# EAGLE design Clock Schematic v.8_no_jumpers (EAGLE 9.3.0)
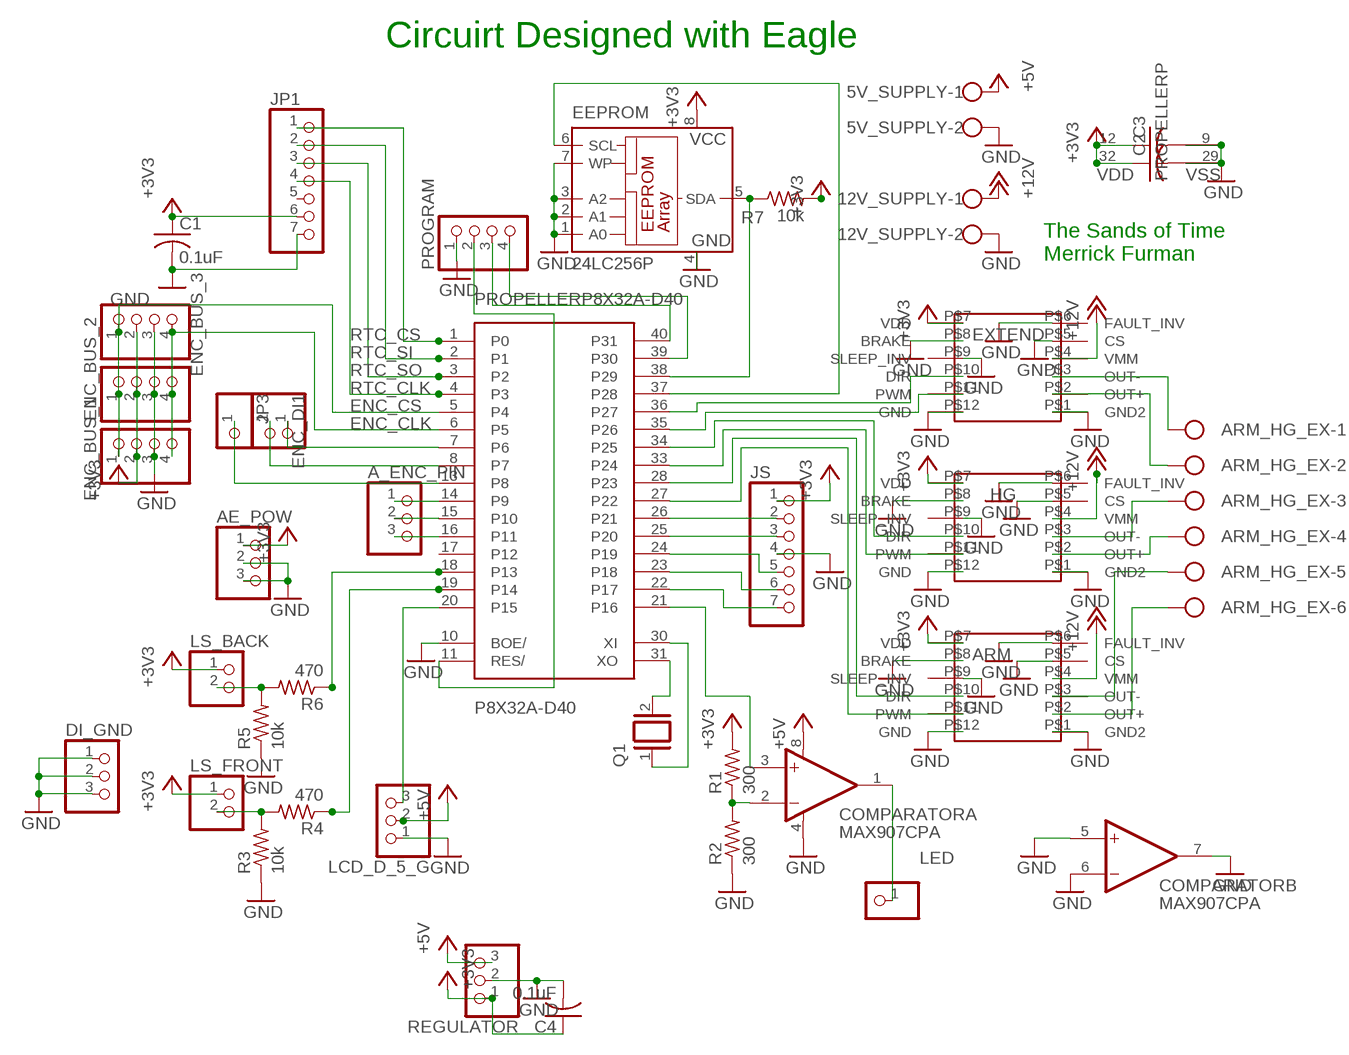
[diagram p0: schematic, sheet 1]

## Parts
5V_SUPPLY  W237-102  [W237-102]
12V_SUPPLY  W237-102  [W237-102]
A_ENC_PIN  PINHD-1X3  [1X03]
AE_POW  PINHD-1X3  [1X03]
ARM  DRV  [DRV]
ARM_HG_EX  W237-6  [W237-6]
C1  0.1uF  C-US050-025X075  [C050-025X075]
C2  C-US050-025X075  [C050-025X075]
C3  C-US050-025X075  [C050-025X075]
C4  0.1uF  C-US025-030X050  [C025-030X050]
COMPARATOR  MAX907CPA  [DIL08]
DI_GND  PINHD-1X3  [1X03]
EEPROM  24LC256P  [DIL8]
ENC_BUS_1  PINHD-1X4  [1X04]
ENC_BUS_2  PINHD-1X4  [1X04]
ENC_BUS_3  PINHD-1X4  [1X04]
ENC_DI1  PINHD-1X2  [1X02]
EXTEND  DRV  [DRV]
HG  DRV  [DRV]
JP1  PINHD-1X7  [1X07]
JP3  PINHD-1X1  [1X01]
JS  PINHD-1X7  [1X07]
LCD_D_5_G  PINHD-1X3  [1X03]
LED  PINHD-1X1  [1X01]
LS_BACK  PINHD-1X2  [1X02]
LS_FRONT  PINHD-1X2  [1X02]
PROGRAM  PINHD-1X4  [1X04]
PROPELLER  P8X32A-D40  [P8X32A-D40]
Q1  XTAL/S  [QS]
R1  300  R-US_0207/10  [0207/10]
R2  300  R-US_0207/10  [0207/10]
R3  10k  R-US_0207/10  [0207/10]
R4  470  R-US_0207/10  [0207/10]
R5  10k  R-US_0207/10  [0207/10]
R6  470  R-US_0207/10  [0207/10]
R7  10k  R-US_0207/10  [0207/10]
REGULATOR  PINHD-1X3  [1X03]

## Nets
+3V3: AE_POW.1 ARM.P$7(VDD) C1.1 C2.1 C3.1 C4.1 EEPROM.8(VCC) ENC_BUS_1.2 ENC_BUS_2.2 ENC_BUS_3.2 EXTEND.P$7(VDD) HG.P$7(VDD) JP1.6 JS.1 LS_BACK.1 LS_FRONT.1 PROPELLER.12(P:VDD) PROPELLER.32(P:VDD) R1.2 R7.2 REGULATOR.1
+5V: 5V_SUPPLY.1 COMPARATOR.8(A:V+) LCD_D_5_G.2 REGULATOR.3
+12V: 12V_SUPPLY.1 ARM.P$4(VMM) EXTEND.P$4(VMM) HG.P$4(VMM)
ENC_CLK: ENC_BUS_1.4 ENC_BUS_2.4 ENC_BUS_3.4 PROPELLER.6(P8X32A-D40:P5)
ENC_CS: ENC_BUS_1.1 ENC_BUS_2.1 ENC_BUS_3.1 PROPELLER.5(P8X32A-D40:P4)
GND: 5V_SUPPLY.2 12V_SUPPLY.2 AE_POW.2 AE_POW.3 ARM.P$1(GND2) ARM.P$5(CS) ARM.P$6(FAULT_INV) ARM.P$8(BRAKE) ARM.P$9(SLEEP_INV) ARM.P$12(GND) C1.2 C2.2 C3.2 C4.2 COMPARATOR.4(A:V-) COMPARATOR.5(B:+IN) COMPARATOR.6(B:-IN) COMPARATOR.7(B:OUT) DI_GND.1 DI_GND.2 DI_GND.3 EEPROM.1(A0) EEPROM.2(A1) EEPROM.3(A2) EEPROM.4(GND) EEPROM.7(WP) ENC_BUS_1.3 ENC_BUS_2.3 ENC_BUS_3.3 EXTEND.P$1(GND2) EXTEND.P$5(CS) EXTEND.P$6(FAULT_INV) EXTEND.P$8(BRAKE) EXTEND.P$9(SLEEP_INV) EXTEND.P$12(GND) HG.P$1(GND2) HG.P$5(CS) HG.P$6(FAULT_INV) HG.P$8(BRAKE) HG.P$9(SLEEP_INV) HG.P$12(GND) JP1.7 JS.4 LCD_D_5_G.1 PROGRAM.1 PROPELLER.9(P:VSS) PROPELLER.10(P8X32A-D40:BOE/) PROPELLER.29(P:VSS) R2.1 R3.1 R5.1 REGULATOR.2
N$1: ENC_DI1.1 PROPELLER.7(P8X32A-D40:P6)
N$2: JS.5 PROPELLER.24(P8X32A-D40:P19)
N$3: JS.6 PROPELLER.23(P8X32A-D40:P18)
N$4: JS.7 PROPELLER.22(P8X32A-D40:P17)
N$5: JS.3 PROPELLER.25(P8X32A-D40:P20)
N$6: JS.2 PROPELLER.26(P8X32A-D40:P21)
N$7: LCD_D_5_G.3 PROPELLER.20(P8X32A-D40:P15)
N$8: ENC_DI1.2 PROPELLER.8(P8X32A-D40:P7)
N$9: COMPARATOR.1(A:OUT) LED.1
N$10: PROPELLER.31(P8X32A-D40:XO) Q1.2
N$11: COMPARATOR.2(A:-IN) R1.1 R2.2
N$12: PROPELLER.30(P8X32A-D40:XI) Q1.1
N$13: PROPELLER.19(P8X32A-D40:P14) R4.1
N$14: LS_BACK.2 R5.2 R6.2
N$15: PROPELLER.18(P8X32A-D40:P13) R6.1
N$16: EEPROM.6(SCL) PROPELLER.37(P8X32A-D40:P28)
N$17: ARM.P$11(PWM) PROPELLER.27(P8X32A-D40:P22)
N$18: PROGRAM.4 PROPELLER.39(P8X32A-D40:P30)
N$19: PROGRAM.3 PROPELLER.40(P8X32A-D40:P31)
N$20: EEPROM.5(SDA) PROPELLER.38(P8X32A-D40:P29) R7.1
N$21: COMPARATOR.3(A:+IN) PROPELLER.21(P8X32A-D40:P16)
N$22: ARM.P$10(DIR) PROPELLER.28(P8X32A-D40:P23)
N$23: HG.P$11(PWM) PROPELLER.33(P8X32A-D40:P24)
N$24: HG.P$10(DIR) PROPELLER.34(P8X32A-D40:P25)
N$25: EXTEND.P$11(PWM) PROPELLER.35(P8X32A-D40:P26)
N$26: PROGRAM.2 PROPELLER.11(P8X32A-D40:RES/)
N$27: LS_FRONT.2 R3.2 R4.2
N$28: EXTEND.P$10(DIR) PROPELLER.36(P8X32A-D40:P27)
N$29: ARM_HG_EX.1 EXTEND.P$3(OUT-)
N$30: ARM_HG_EX.2 EXTEND.P$2(OUT+)
N$31: ARM_HG_EX.3 HG.P$3(OUT-)
N$32: ARM_HG_EX.4 HG.P$2(OUT+)
N$33: ARM.P$3(OUT-) ARM_HG_EX.5
N$34: ARM.P$2(OUT+) ARM_HG_EX.6
N$35: JP3.1 PROPELLER.13(P8X32A-D40:P8)
N$36: A_ENC_PIN.1 PROPELLER.14(P8X32A-D40:P9)
N$37: A_ENC_PIN.2 PROPELLER.15(P8X32A-D40:P10)
N$38: A_ENC_PIN.3 PROPELLER.16(P8X32A-D40:P11)
RTC_CLK: JP1.4 PROPELLER.4(P8X32A-D40:P3)
RTC_CS: JP1.1 PROPELLER.1(P8X32A-D40:P0)
RTC_SI: JP1.2 PROPELLER.2(P8X32A-D40:P1)
RTC_SO: JP1.3 PROPELLER.3(P8X32A-D40:P2)
Unconnected: JP1.5 PROPELLER.17(P8X32A-D40:P12)

## Notes on the sheet
- Circuirt Designed with Eagle
- The Sands of Time
  Merrick Furman

## Library data of the parts
5V_SUPPLY 12V_SUPPLY = con-wago-500:W237-102: WAGO SCREW CLAMP; MPN: 237-102; OC_FARNELL: unknown; OC_NEWARK: 70K9898
A_ENC_PIN AE_POW DI_GND LCD_D_5_G REGULATOR = pinhead:PINHD-1X3: PIN HEADER
ARM EXTEND HG = Pololu_DRV8801_Breakout:DRV
ARM_HG_EX = con-wago-500:W237-6: WAGO SCREW CLAMP; OC_FARNELL: unknown; OC_NEWARK: unknown
C1-C4 = rcl:C-US: CAPACITOR, American symbol; SPICEPREFIX: C
COMPARATOR = maxim:MAX907CPA: COMPARATOR; MF: MAXIM; MPN: MAX907CPA; OC_FARNELL: unknown; OC_NEWARK: 79C3004; SPICEPREFIX: X
EEPROM = microchip:24*: Serial EEPROM I2C; MF: MICROCHIP; MPN: 24LC256-E/P; OC_FARNELL: 9757970; OC_NEWARK: 92C7169
ENC_BUS_1-ENC_BUS_3 PROGRAM = pinhead:PINHD-1X4: PIN HEADER
ENC_DI1 LS_BACK LS_FRONT = pinhead:PINHD-1X2: PIN HEADER
JP1 JS = pinhead:PINHD-1X7: PIN HEADER
JP3 LED = pinhead:PINHD-1X1: PIN HEADER
PROPELLER = parallax_propeller:P8X32A-D40
Q1 = special:XTAL/S: CRYSTAL
R1-R7 = rcl:R-US_: RESISTOR, American symbol; SPICEPREFIX: R

## Board
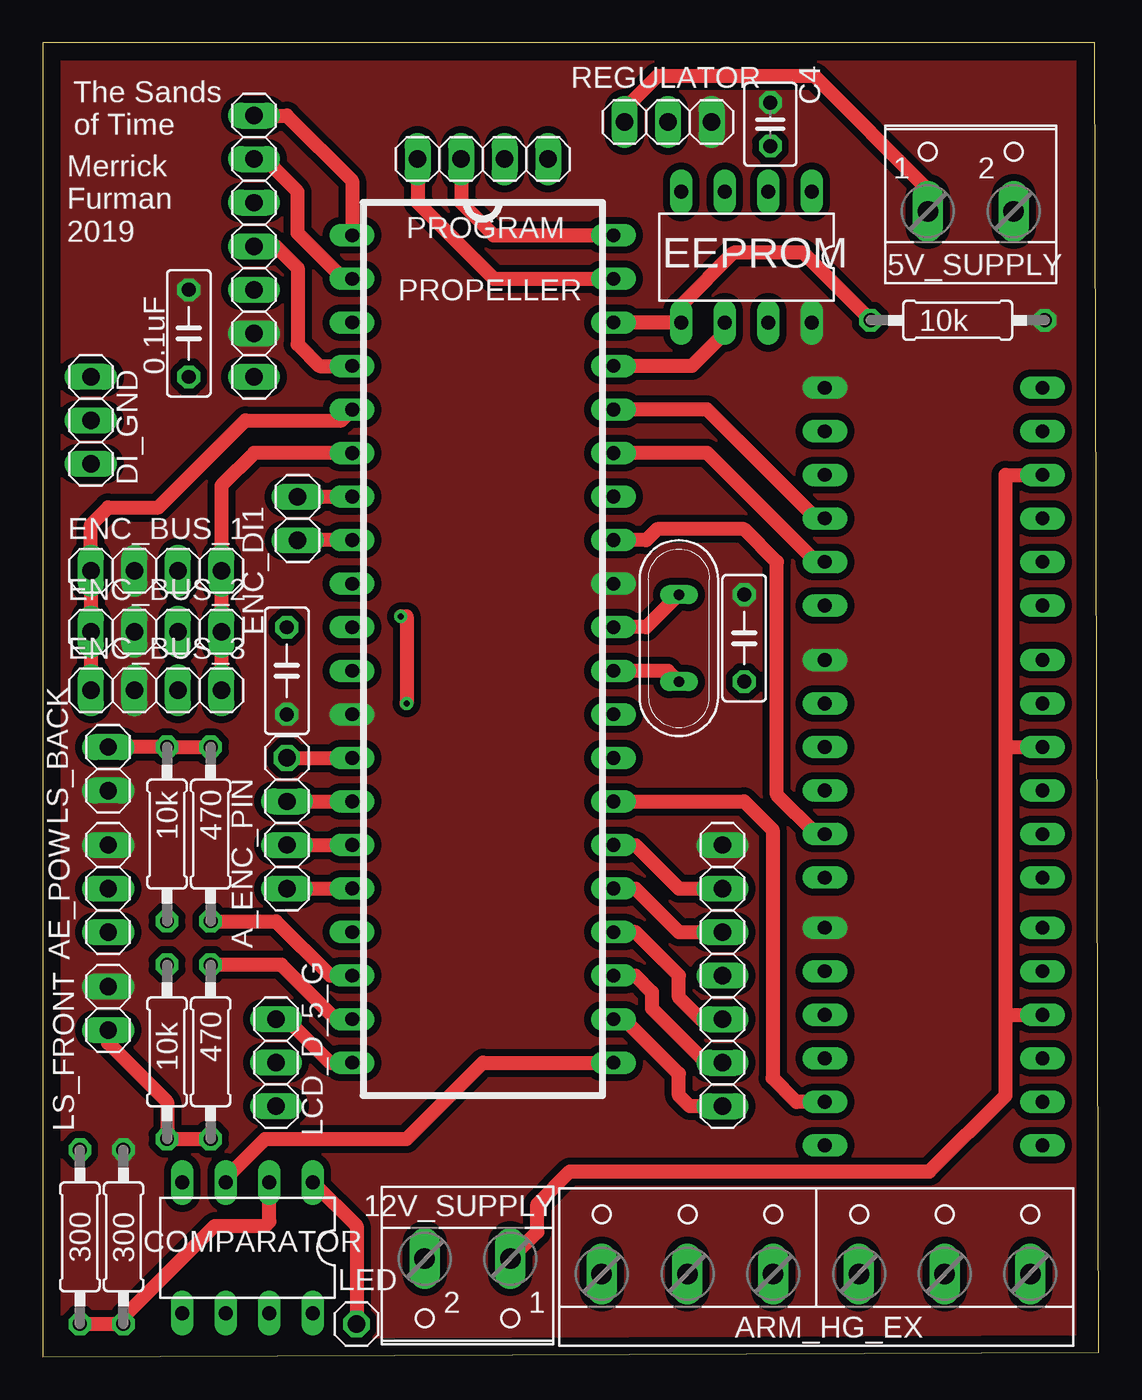
[diagram p1: board, top side]
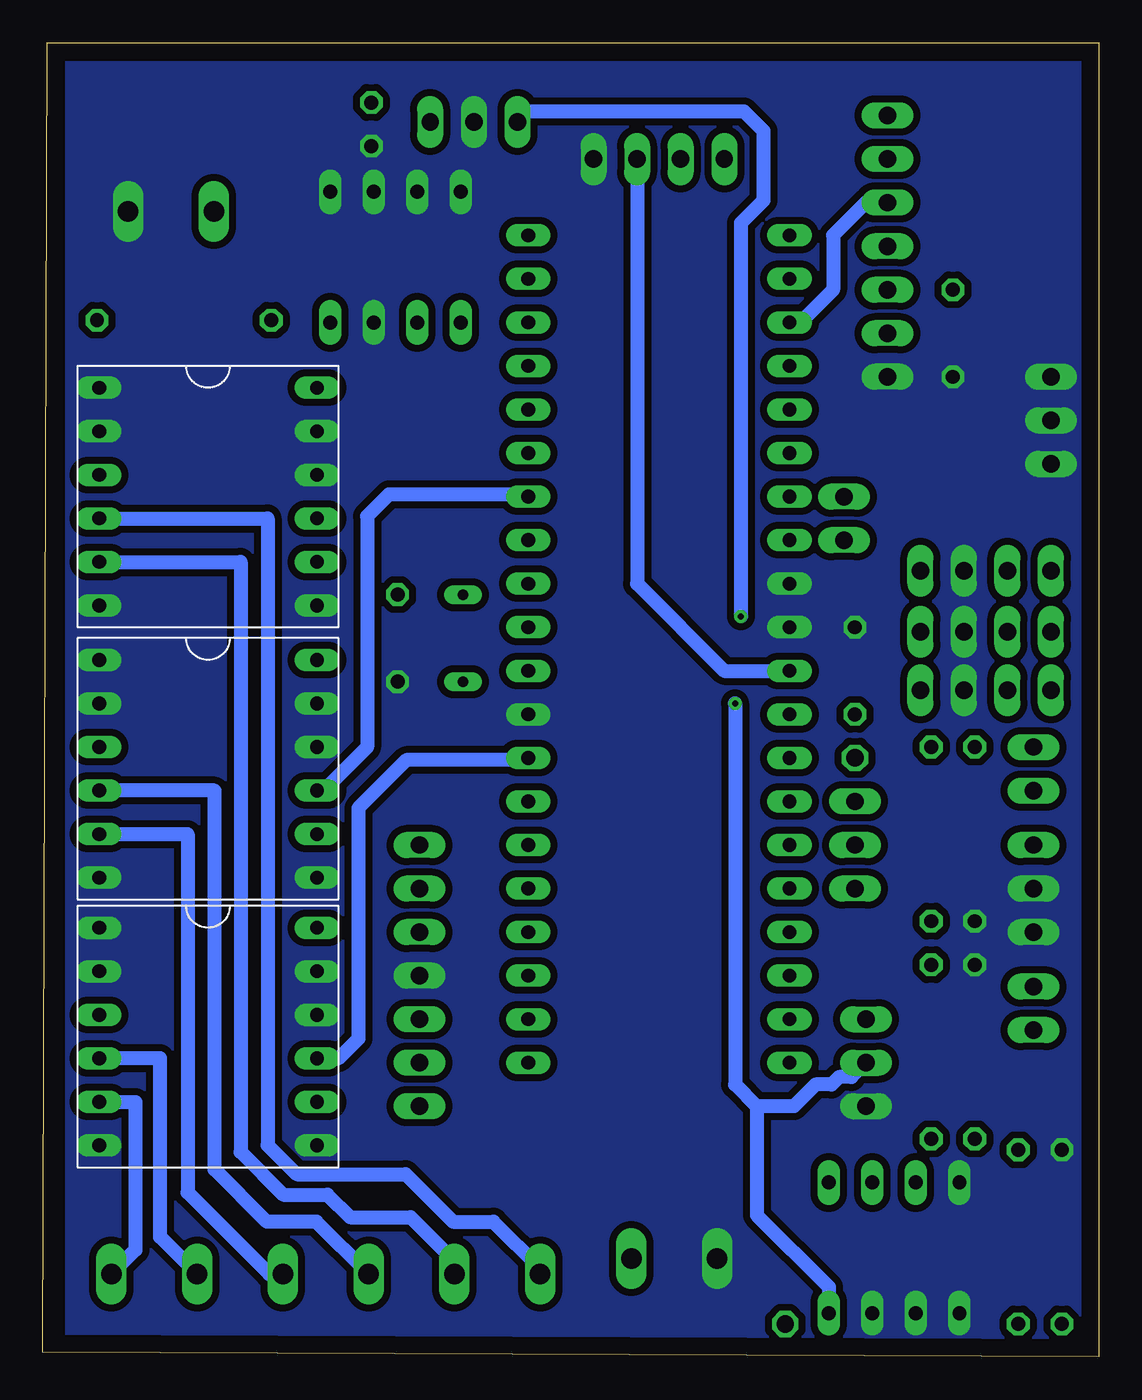
[diagram p2: board, bottom side, seen from below]

Size 61.58 x 76.63 mm. Coordinates in mm from the lower left corner, seen from the top.
Outline: 0,0 61.58,0.25 61.32,76.63 0,76.63 0,0
Copper layers (1*16): Top 0.035mm / dielectric 1.5mm / Bottom 0.035mm
Design rules "default *": minimum track width 6mil, minimum drill 0.35mm, track to track 15mil, track to pad 15mil, pad to pad 15mil, via to via 15mil, smd to smd 15mil, copper to edge 40mil, drill to drill 6mil, minimum pad ring 10mil, minimum via ring 8mil, stop-mask expansion 4mil, vias tented up to drill 0mil, thermal gap 10mil

### Footprints (pad centres in the part's own frame; a part is rotated, then mirrored left to right if it is on the bottom)
W237-102 = drill 1.194 long: 1 -2.5,-1.27; 2 2.5,-1.27
1X03 = drill 1.016 long: 1 -2.54,0; 2 0,0; 3 2.54,0
DRV = drill 0.8 long: P$1 1.27,1.27; P$2 1.27,3.81; P$3 1.27,6.35; P$4 1.27,8.89; P$5 1.27,11.43; P$6 1.27,13.97; P$7 13.97,13.97; P$8 13.97,11.43; P$9 13.97,8.89; P$10 13.97,6.35; P$11 13.97,3.81; P$12 13.97,1.27
W237-6 = drill 1.194 long: 1 -12.5,-1.27; 2 -7.5,-1.27; 3 -2.5,-1.27; 4 2.5,-1.27; 5 7.5,-1.27; 6 12.5,-1.27
C050-025X075 = drill 0.813 octagon: 1 -2.54,0; 2 2.54,0
C025-030X050 = drill 0.813 octagon: 1 -1.27,0; 2 1.27,0
DIL08 = drill 0.813 long: 1 -3.81,-3.81; 2 -1.27,-3.81; 3 1.27,-3.81; 4 3.81,-3.81; 5 3.81,3.81; 6 1.27,3.81; 7 -1.27,3.81; 8 -3.81,3.81
DIL8 = drill 0.813 long: 1 -3.81,-3.81; 2 -1.27,-3.81; 3 1.27,-3.81; 4 3.81,-3.81; 5 3.81,3.81; 6 1.27,3.81; 7 -1.27,3.81; 8 -3.81,3.81
1X04 = drill 1.016 long: 1 -3.81,0; 2 -1.27,0; 3 1.27,0; 4 3.81,0
1X02 = drill 1.016 long: 1 -1.27,0; 2 1.27,0
1X07 = drill 1.016 long: 1 -7.62,0; 2 -5.08,0; 3 -2.54,0; 4 0,0; 5 2.54,0; 6 5.08,0; 7 7.62,0
1X01 = drill 1.016 octagon: 1 0,0
P8X32A-D40 = drill 0.8 long: 1 -7.62,23.495; 2 -7.62,20.955; 3 -7.62,18.415; 4 -7.62,15.875; 5 -7.62,13.335; 6 -7.62,10.795; 7 -7.62,8.255; 8 -7.62,5.715; 9 -7.62,3.175; 10 -7.62,0.635; 11 -7.62,-1.905; 12 -7.62,-4.445; 13 -7.62,-6.985; 14 -7.62,-9.525; 15 -7.62,-12.065; 16 -7.62,-14.605; 17 -7.62,-17.145; 18 -7.62,-19.685; 19 -7.62,-22.225; 20 -7.62,-24.765; 21 7.62,-24.765; 22 7.62,-22.225; 23 7.62,-19.685; 24 7.62,-17.145; 25 7.62,-14.605; 26 7.62,-12.065; 27 7.62,-9.525; 28 7.62,-6.985; 29 7.62,-4.445; 30 7.62,-1.905; 31 7.62,0.635; 32 7.62,3.175; 33 7.62,5.715; 34 7.62,8.255; 35 7.62,10.795; 36 7.62,13.335; 37 7.62,15.875; 38 7.62,18.415; 39 7.62,20.955; 40 7.62,23.495
QS = drill 0.61 long: 1 -2.54,0; 2 2.54,0
0207/10 = drill 0.813 octagon: 1 -5.08,0; 2 5.08,0

### Placement (x,y rotation side)
5V_SUPPLY  54.1,68.07 0 top
12V_SUPPLY  24.77,4.45 180 top
A_ENC_PIN  14.22,29.84 270 top
AE_POW  3.81,27.3 270 top
ARM  59.56,11.05 0 bottom
ARM_HG_EX  45.09,6.1 0 top
C1  8.51,59.69 270 top
C2  40.89,41.91 270 top
C3  14.22,40.01 90 top
C4  42.42,71.88 270 top
COMPARATOR  11.94,6.35 180 top
DI_GND  2.79,54.61 90 top
EEPROM  41.02,64.14 180 top
ENC_BUS_1  6.6,45.85 0 top
ENC_BUS_2  6.6,42.29 0 top
ENC_BUS_3  6.6,38.86 0 top
ENC_DI1  14.86,48.9 270 top
EXTEND  59.56,42.55 0 bottom
HG  59.56,26.67 0 bottom
JP1  12.32,64.77 270 top
JP3  14.22,34.92 0 top
JS  39.62,22.23 270 top
LCD_D_5_G  13.59,17.14 90 top
LED  18.29,1.91 0 top
LS_BACK  3.81,34.29 90 top
LS_FRONT  3.81,20.32 270 top
PROGRAM  25.65,69.85 180 top
PROPELLER  25.65,41.91 0 top
Q1  37.08,41.91 90 top
R1  4.7,6.99 90 top
R2  2.16,6.99 270 top
R3  7.24,17.78 270 top
R4  9.78,17.78 270 top
R5  7.24,30.48 90 top
R6  9.78,30.48 90 top
R7  53.34,60.45 0 top
REGULATOR  36.45,72.01 180 top

### Tracks (layer width: path | path; a pad name or v marks a point on that pad's centre or on a via)
+3V3
  pour Top (isolate 0.406, no thermals): 0.25,75.95 60.2,75.95 60.2,0.51 0.25,0.51
+5V  (via drill 0.35)
  Top 0.813: v20.88,43.18 21.21,43.18 v21.21,38.1 | 5V_SUPPLY.1 51.6,68.07 45,74.68 35.81,74.68 33.91,72.77 REGULATOR.3
  Bottom 0.813: LCD_D_5_G.2 14.43,16.31 15.15,16.31 15.58,15.88 16.51,15.88 17.78,14.61 19.94,14.61 | 19.94,14.61 19.94,8.26 15.75,4.06 COMPARATOR.8 | 19.94,14.61 21.21,15.88 v21.21,38.1 | REGULATOR.3 33.27,72.64 20.7,72.64 19.56,71.5 19.56,67.44 20.88,66.12 v20.88,43.18
+12V
  Top 0.813: 12V_SUPPLY.1 28.83,7.28 28.83,8.89 30.73,10.79 51.69,10.79 56.13,15.24 56.13,19.94 | 56.13,19.94 ARM.P$4 | 56.13,35.56 HG.P$4 | EXTEND.P$4 56.13,51.44 56.13,35.56 | 56.13,19.94 56.13,35.56
ENC_CLK
  Top 0.813: ENC_BUS_3.4 ENC_BUS_2.4 ENC_BUS_1.4 10.41,50.8 12.32,52.7 PROPELLER.6
ENC_CS
  Top 0.813: ENC_BUS_3.1 ENC_BUS_2.1 ENC_BUS_1.1 2.79,48.51 3.81,49.53 6.73,49.53 11.81,54.61 17.4,54.61 PROPELLER.5
GND
  pour Bottom (isolate 0.406, no thermals): 0.01,76.07 60.2,76.07 60.2,0.51 0.25,0.51
N$1
  Top 0.813: ENC_DI1.1 PROPELLER.7
N$2
  Top 0.813: PROPELLER.24 34.54,24.77 37.08,22.23 37.08,20.95 38.35,19.68 JS.5
N$3
  Top 0.813: PROPELLER.23 34.54,22.23 35.51,21.26 35.51,20.3 38.67,17.14 JS.6
N$4
  Top 0.813: JS.7 37.72,14.61 37.08,15.24 37.08,16.5 33.9,19.68 PROPELLER.22
N$5
  Top 0.813: PROPELLER.25 34.54,27.3 37.08,24.77 JS.3
N$6
  Top 0.813: PROPELLER.26 34.54,29.84 37.08,27.3 JS.2
N$7
  Top 0.813: PROPELLER.20 16.76,17.14 14.22,19.68 LCD_D_5_G.3
N$8
  Top 0.813: PROPELLER.8 ENC_DI1.2
N$9
  Top 0.813: COMPARATOR.1 18.29,7.62 LED.1
N$10
  Top 0.813: Q1.2 35.18,42.55 PROPELLER.31
N$11
  Top 0.813: R2.2 R1.1 4.7,2.29 10.03,7.62 12.95,7.62 13.21,7.87 COMPARATOR.2
N$12
  Top 0.813: Q1.1 36.45,40.01 PROPELLER.30
N$13
  Top 0.813: PROPELLER.19 17.08,19.68 13.9,22.86 R4.1
N$14
  Top 0.813: R6.2 R5.2 LS_BACK.2
N$15
  Top 0.813: R6.1 13.59,25.4 16.76,22.23 PROPELLER.18
N$16
  Top 0.813: EEPROM.6 39.75,59.69 37.85,57.78 PROPELLER.37
N$17
  Top 0.813: ARM.P$11 43.94,14.86 42.55,16.26 42.55,30.73 40.89,32.38 PROPELLER.27
N$18
  Top 0.813: PROGRAM.4 21.84,67.31 26.29,62.87 PROPELLER.39
N$19
  Top 0.813: PROGRAM.3 24.38,67.31 26.29,65.41 PROPELLER.40
N$20
  Top 0.813: PROPELLER.38 EEPROM.5 37.21,61.34 40.26,64.39 44.32,64.39 R7.1
N$21
  Top 0.813: PROPELLER.21 25.65,17.14 21.21,12.7 12.95,12.7 10.67,10.41 COMPARATOR.3
N$22
  Bottom 0.813: PROPELLER.28 33.4,34.8 40.39,34.8 43.18,32 43.18,18.54 44.32,17.4 ARM.P$10
N$23
  Top 0.813: HG.P$11 45.09,30.48 42.8,32.77 42.8,46.35 40.89,48.26 35.81,48.26 35.18,47.62 PROPELLER.33
N$24
  Bottom 0.813: PROPELLER.34 33.4,50.29 41.4,50.29 42.67,49.02 42.67,35.56 45.21,33.02 HG.P$10
N$25
  Top 0.813: EXTEND.P$11 45.09,46.35 38.73,52.7 PROPELLER.35
N$26
  Bottom 0.813: PROPELLER.11 21.84,40.01 26.92,45.09 PROGRAM.2
N$27
  Top 0.813: R4.2 R3.2 7.24,14.86 3.81,18.29 LS_FRONT.2
N$28
  Top 0.813: EXTEND.P$10 45.09,48.9 38.73,55.24 PROPELLER.36
N$29
  Bottom 0.813: EXTEND.P$3 48.46,48.9 48.46,12.34 46.77,10.64 40.42,10.64 37.65,7.87 35.31,7.87 32.59,5.15 ARM_HG_EX.1
N$30
  Bottom 0.813: EXTEND.P$2 50.04,46.35 50.04,11.94 47.55,9.45 44.98,9.45 43.66,8.13 40.13,8.13 37.59,5.58 ARM_HG_EX.2
N$31
  Bottom 0.813: HG.P$3 51.56,33.02 51.56,10.92 48.51,7.87 45.63,7.87 ARM_HG_EX.3
N$32
  Bottom 0.813: HG.P$2 53.14,30.48 53.14,9.58 48.39,4.83 ARM_HG_EX.4
N$33
  Bottom 0.813: ARM_HG_EX.5 54.74,6.98 54.74,17.4 ARM.P$3
N$34
  Bottom 0.813: ARM.P$2 56.19,14.86 56.19,6.23 ARM_HG_EX.6
N$35
  Top 0.813: JP3.1 PROPELLER.13
N$36
  Top 0.813: A_ENC_PIN.1 PROPELLER.14
N$37
  Top 0.813: A_ENC_PIN.2 PROPELLER.15
N$38
  Top 0.813: A_ENC_PIN.3 PROPELLER.16
RTC_CLK
  Top 0.813: JP1.4 13.59,64.77 14.86,63.5 14.86,59.05 16.13,57.78 PROPELLER.4
RTC_CS
  Top 0.813: JP1.1 14.22,72.39 18.03,68.58 PROPELLER.1
RTC_SI
  Top 0.813: PROPELLER.2 17.53,62.87 14.86,65.53 14.86,67.94 12.95,69.85 JP1.2
RTC_SO
  Bottom 0.813: JP1.3 13.59,67.31 15.49,65.41 15.49,62.23 17.4,60.33 PROPELLER.3

### Text on the board
tNames: The Sands / of Time | Merrick / Furman / 2019